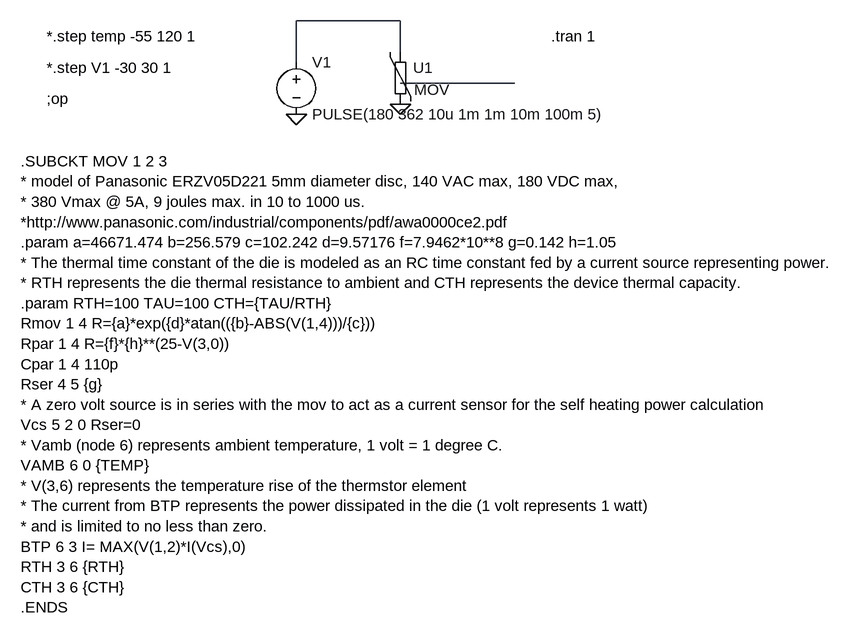
[diagram p0: schematic MOV_with_temperature_1.asc]
MOV_with_temperature_1.asc, the LTspice schematic file:
Version 4
SHEET 1 2012 1608
WIRE 208 96 208 32
WIRE 368 32 208 32
WIRE 368 80 368 32
WIRE 544 128 368 128
FLAG 368 160 0
FLAG 208 176 0
SYMBOL voltage 208 80 R0
WINDOW 123 0 0 Left 0
WINDOW 39 0 0 Left 0
SYMATTR InstName V1
SYMATTR Value PULSE(180 362 10u 1m 1m 10m 100m 5)
SYMBOL MOV_with_temp_monitor 352 64 R0
SYMATTR InstName U1
TEXT -176 152 Left 0 !;op
TEXT -176 56 Left 0 !*.step temp -55 120 1
TEXT -176 104 Left 0 !*.step V1 -30 30 1
TEXT -216 248 Left 0 !.SUBCKT MOV 1 2 3\n* model of Panasonic ERZV05D221 5mm diameter disc, 140 VAC max, 180 VDC max, \n* 380 Vmax @ 5A, 9 joules max. in 10 to 1000 us. \n*http://www.panasonic.com/industrial/components/pdf/awa0000ce2.pdf\n.param a=46671.474 b=256.579 c=102.242 d=9.57176 f=7.9462*10**8 g=0.142 h=1.05\n* The thermal time constant of the die is modeled as an RC time constant fed by a current source representing power.\n* RTH represents the die thermal resistance to ambient and CTH represents the device thermal capacity.\n.param RTH=100 TAU=100 CTH={TAU/RTH} \nRmov 1 4 R={a}*exp({d}*atan(({b}-ABS(V(1,4)))/{c}))\nRpar 1 4 R={f}*{h}**(25-V(3,0))\nCpar 1 4 110p\nRser 4 5 {g}\n* A zero volt source is in series with the mov to act as a current sensor for the self heating power calculation\nVcs 5 2 0 Rser=0\n* Vamb (node 6) represents ambient temperature, 1 volt = 1 degree C.\nVAMB 6 0 {TEMP}\n* V(3,6) represents the temperature rise of the thermstor element\n* The current from BTP represents the power dissipated in the die (1 volt represents 1 watt)\n* and is limited to no less than zero.\nBTP 6 3 I= MAX(V(1,2)*I(Vcs),0)\nRTH 3 6 {RTH}\nCTH 3 6 {CTH}\n.ENDS
TEXT 600 56 Left 0 !.tran 1

The netlist it stands for:
* MOV_with_temperature_1.asc
V1 N001 0 PULSE(180 362 10u 1m 1m 10m 100m 5)
XU1 N001 0 N002 MOV  ; pins A B ?
;op
*.step temp -55 120 1
*.step V1 -30 30 1
.SUBCKT MOV 1 2 3
* model of Panasonic ERZV05D221 5mm diameter disc, 140 VAC max, 180 VDC max,
* 380 Vmax @ 5A, 9 joules max. in 10 to 1000 us.
*http://www.panasonic.com/industrial/components/pdf/awa0000ce2.pdf
.param a=46671.474 b=256.579 c=102.242 d=9.57176 f=7.9462*10**8 g=0.142 h=1.05
* The thermal time constant of the die is modeled as an RC time constant fed by a current source representing power.
* RTH represents the die thermal resistance to ambient and CTH represents the device thermal capacity.
.param RTH=100 TAU=100 CTH={TAU/RTH}
Rmov 1 4 R={a}*exp({d}*atan(({b}-ABS(V(1,4)))/{c}))
Rpar 1 4 R={f}*{h}**(25-V(3,0))
Cpar 1 4 110p
Rser 4 5 {g}
* A zero volt source is in series with the mov to act as a current sensor for the self heating power calculation
Vcs 5 2 0 Rser=0
* Vamb (node 6) represents ambient temperature, 1 volt = 1 degree C.
VAMB 6 0 {TEMP}
* V(3,6) represents the temperature rise of the thermstor element
* The current from BTP represents the power dissipated in the die (1 volt represents 1 watt)
* and is limited to no less than zero.
BTP 6 3 I= MAX(V(1,2)*I(Vcs),0)
RTH 3 6 {RTH}
CTH 3 6 {CTH}
.ENDS
.tran 1
.backanno
.end